# EAGLE schematic arduino micro based (EAGLE 7.6.0)
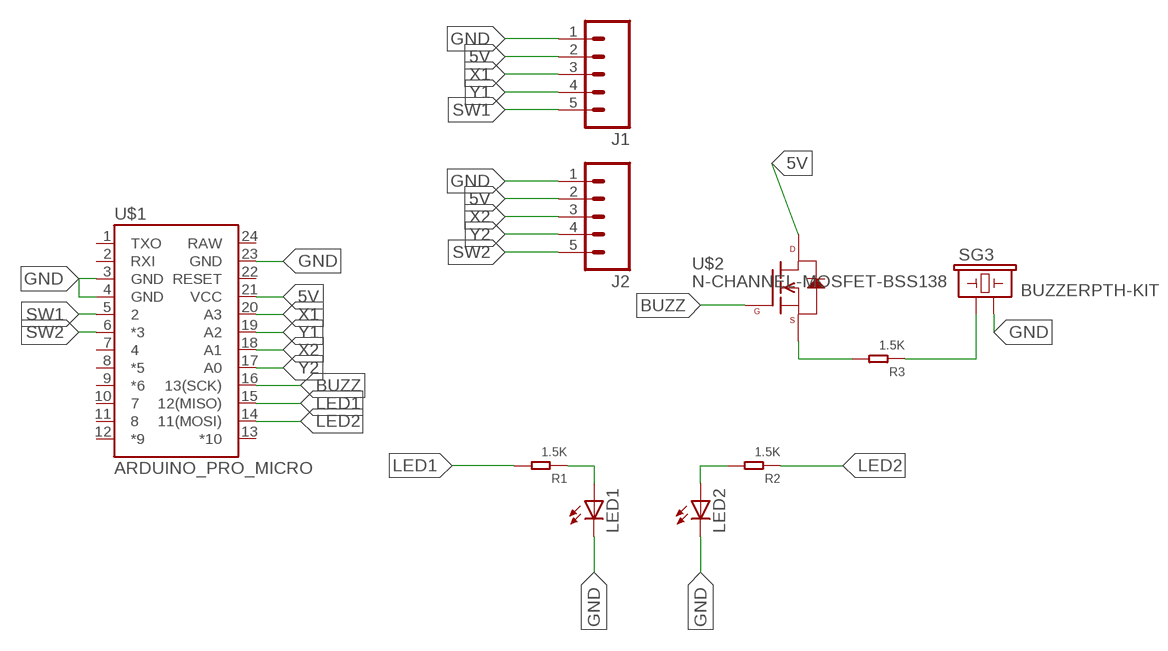
[diagram p0: schematic, sheet 1]

## Parts
J1  M05JST-VERT  [JST-5-PTH-VERT]
J2  M05JST-VERT  [JST-5-PTH-VERT]
LED1  LED5MM  [LED5MM]
LED2  LED5MM  [LED5MM]
R1  1.5K  SMD-RES-1.5K-1%-1/10W(0603)  [R0603]
R2  1.5K  SMD-RES-1.5K-1%-1/10W(0603)  [R0603]
R3  1.5K  SMD-RES-1.5K-1%-1/10W(0603)  [R0603]
SG3  BUZZERPTH-KIT  [BUZZER-12MM-KIT]
U$1  ARDUINO_PRO_MICRO  [ARDUINO_PRO_MICRO]
U$2  N-CHANNEL-MOSFET-BSS138  [SOT23-3]

## Nets
5V: J1.2 J2.2 U$1.21(VCC) U$2.3(D)
BUZZ: U$1.16(13(SCK)) U$2.1(G)
GND: J1.1 J2.1 LED1.K(C) LED2.K(C) SG3.- U$1.3(GND) U$1.4(GND) U$1.23(GND)
LED1: R1.2 U$1.15(12(MISO))
LED2: R2.1 U$1.14(11(MOSI))
N$1: LED1.A R1.1
N$2: LED2.A R2.2
N$3: R3.1 SG3.+
N$4: R3.2 U$2.2(S)
SW1: J1.5 U$1.5
SW2: J2.5 U$1.6(*3)
X1: J1.3 U$1.20(A3)
X2: J2.3 U$1.18(A1)
Y1: J1.4 U$1.19(A2)
Y2: J2.4 U$1.17(A0)
Unconnected: U$1.1(TXO) U$1.2(RXI) U$1.7 U$1.8(*5) U$1.9(*6) U$1.10 U$1.11 U$1.12(*9) U$1.13(*10) U$1.22(RESET) U$1.24(RAW)

## Library data of the parts
J1 J2 = SparkFun-Connectors:M05: Header 5 Standard 5-pin 0.1" header. Use with straight break away headers (SKU : PRT-00116), right angle break away headers (PRT-00553), swiss pins (PRT-00743), machine pins (PRT-00117), and female headers (PRT-00115). Molex polarized connector foot print use with SKU : PRT-08230 with associated crimp pins and housings.
LED1 LED2 = adafruit:LED: LED OSRAM: - CHIPLED LG R971, LG N971, LY N971, LG Q971, LY Q971, LO R971, LY R971 LH N974, LH R974 LS Q976, LO Q976, LY Q976 LO Q996 - Hyper CHIPLED LW Q18S LB Q993, LB Q99A, LB R99A - SideLED LS A670, LO A670, LY A670, LG A670, LP A670 LB A673, LV A673, LT A673, LW A673 LH A674 LY A675 LS A676, LA A676, LO A676, LY A676, LW A676 LS A679, LY A679, LG A679 - Hyper Micro SIDELED® LS Y876, LA Y876, LO Y876, LY Y876 LT Y87S - SmartLED LW L88C, LW L88S LB L89C, LB L89S, LG L890 LS L89K, LO L89K, LY L89K LS L896, LA L896, LO L896, LY L896 - TOPLED LS T670, LO T670, LY T670, LG T670, LP T670 LSG T670, LSP T670, LSY T670, LOP T670, LYG T670 LG T671, LOG T671, LSG T671 LB T673, LV T673, LT T673, LW T673 LH T674 LS T676, LA T676, LO T676, LY T676, LB T676, LH T676, LSB T676, LW T676 LB T67C, LV T67C, LT T67C, LS T67K, LO T67K, LY T67K, LW E67C LS E67B, LA E67B, LO E67B, LY E67B, LB E67C, LV E67C, LT E67C LW T67C LS T679, LY T679, LG T679 LS T770, LO T770, LY T770, LG T770, LP T770 LB T773, LV T773, LT T773, LW T773 LH T774 LS E675, LA E675, LY E675, LS T675 LS T776, LA T776, LO T776, LY T776, LB T776 LHGB T686 LT T68C, LB T68C - Hyper Mini TOPLED® LB M676 - Mini TOPLED Santana® LG M470 LS M47K, LO M47K, LY M47K Source: http://www.osram.convergy.de/
R1-R3 = Seeed-Resistor-2016:SMD-RES-1.5K-1%-1/10W(0603): 301010189; MPN: RC0603FR-071K5L
SG3 = SparkFun-Electromechanical:BUZZER: Buzzer 12mm Spark Fun Electronics SKU : Comp-Buzzer; PROD_ID: COMP-08253
U$1 = SparkFun-Boards:ARDUINO_PRO_MICRO
U$2 = GeekAmmo:N-CHANNEL-MOSFET: N-Channel MOSFET Mode Field Effect Transistor; DATASHEET: http://www.fairchildsemi.com/ds/BS/BSS138.pdf; DIGIKEY: BSS138TR-ND; ELEMENT14: 2323154; URL: http://au.element14.com/fairchild-semiconductor/bss138/mosfet-n-ch-50v-220ma-sot-23/dp/2323154